# EAGLE design test-aetzen (EAGLE 7.1.0)
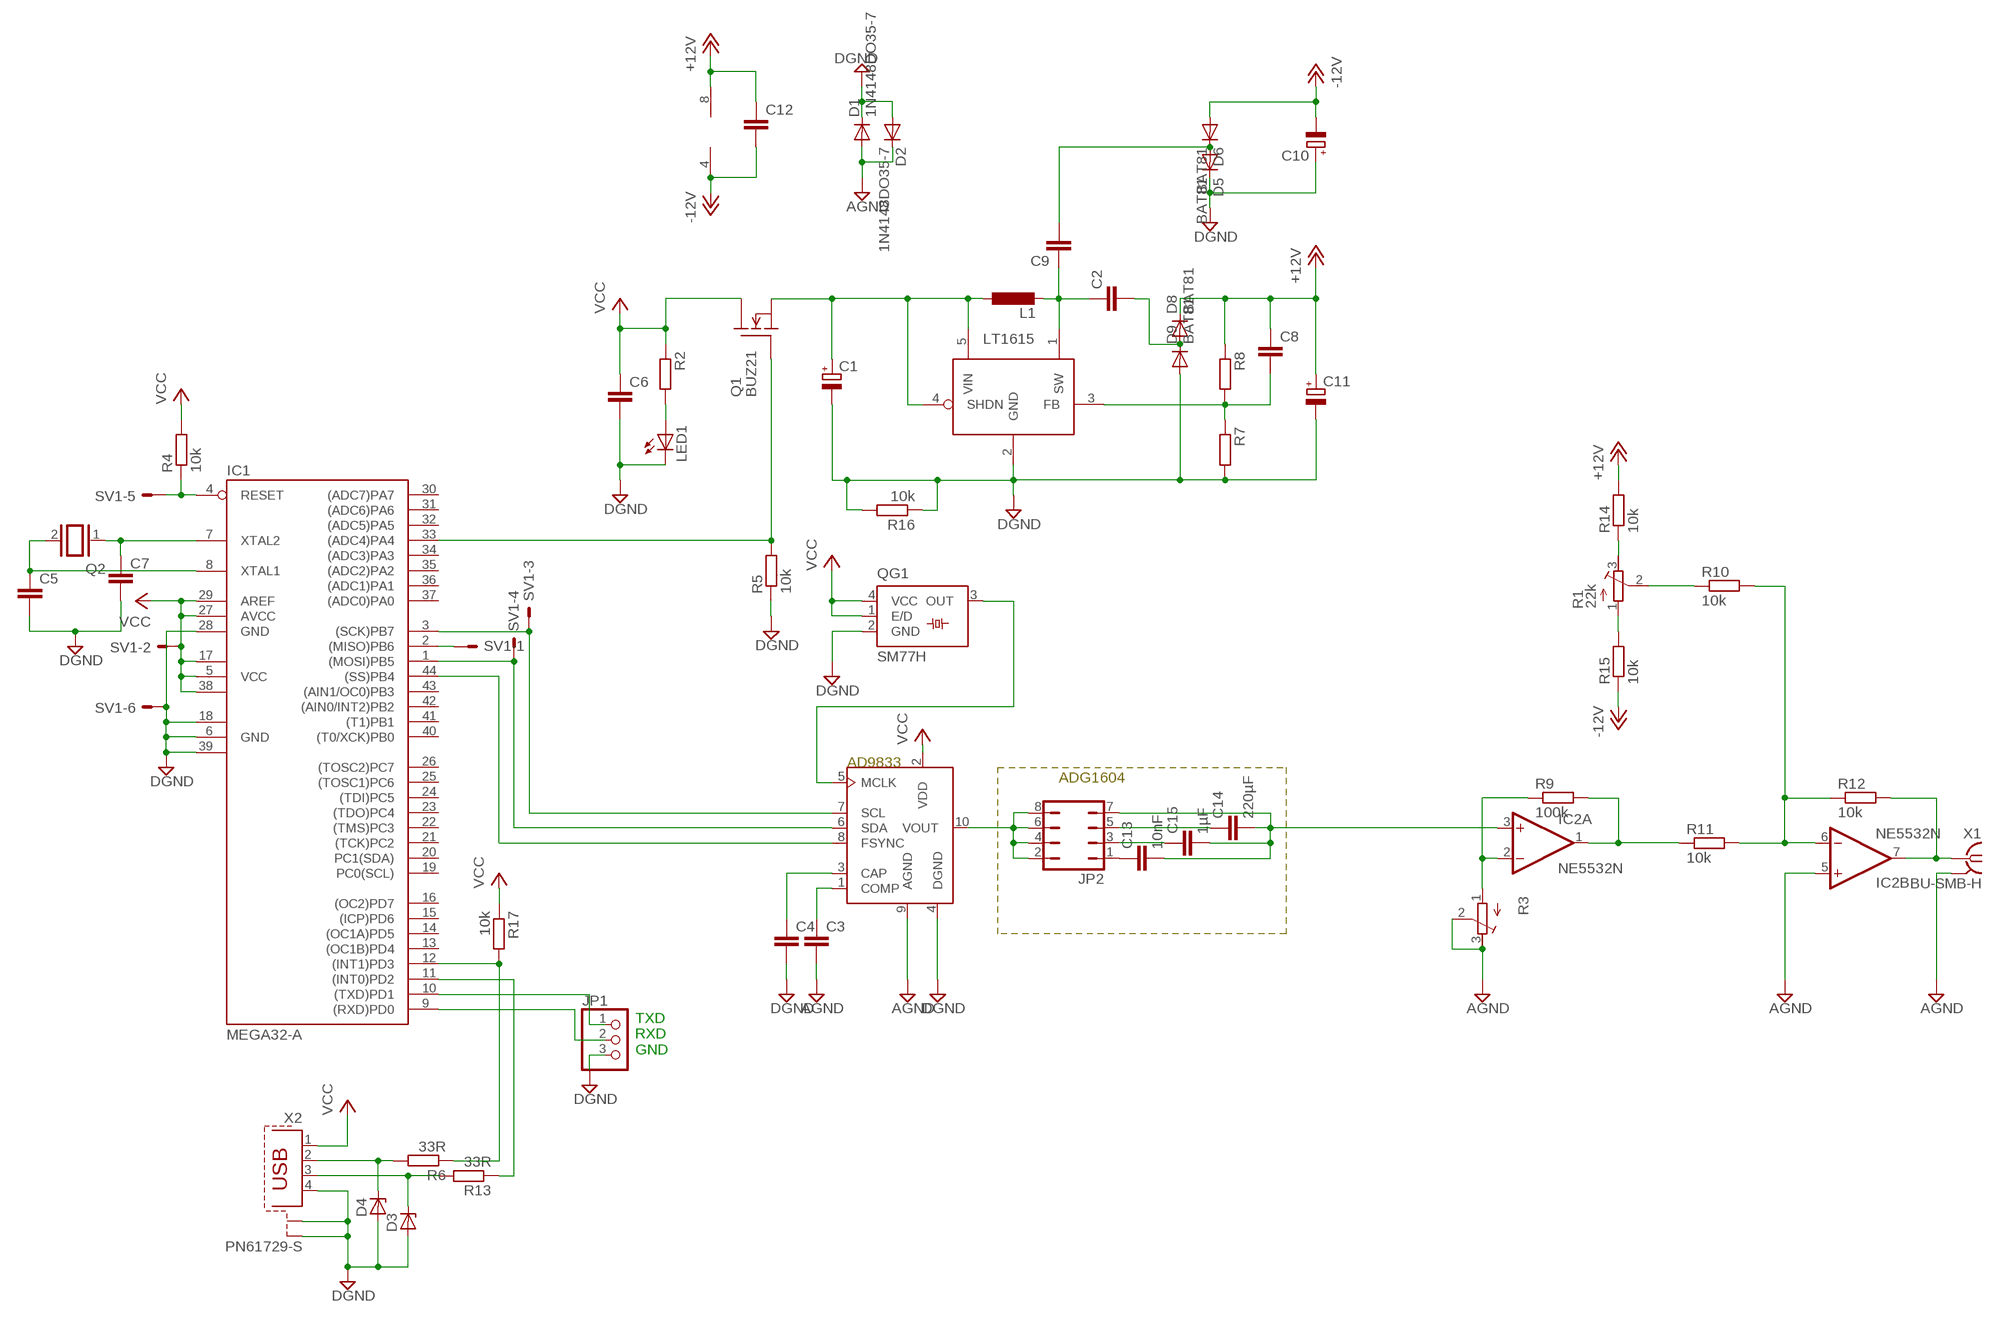
[diagram p0: schematic, sheet 1]

## Parts
C1  CPOL-EUE3.5-8  [E3,5-8]
C2  C-EU025-024X044  [C025-024X044]
C3  C-EU025-024X044  [C025-024X044]
C4  C-EU025-024X044  [C025-024X044]
C5  C-EU025-024X044  [C025-024X044]
C6  C-EU025-024X044  [C025-024X044]
C7  C-EU025-024X044  [C025-024X044]
C8  C-EU025-024X044  [C025-024X044]
C9  C-EU025-024X044  [C025-024X044]
C10  CPOL-EUE3.5-8  [E3,5-8]
C11  CPOL-EUE3.5-8  [E3,5-8]
C12  C-EU025-024X044  [C025-024X044]
C13  10nF  C-EU025-024X044  [C025-024X044]
C14  220µF  C-EU025-024X044  [C025-024X044]
C15  1µF  C-EU025-024X044  [C025-024X044]
D1  1N4148DO35-7  [DO35-7]
D2  1N4148DO35-7  [DO35-7]
D3  ZENER-DIODEDO35Z10  [DO35Z10]
D4  ZENER-DIODEDO35Z10  [DO35Z10]
D5  BAT81  [DO34-7]
D6  BAT81  [DO34-7]
D8  BAT81  [DO34-7]
D9  BAT81  [DO34-7]
IC1  MEGA32-A  [TQFP44]
IC2  NE5532N  [DIL08]
JP1  PINHD-1X3  [1X03]
JP2  JP4Q  [JP4Q]
L1  L-EU0207/10  [0207/10]
LED1  LED5MM  [LED5MM]
Q1  BUZ21  [TO220V]
Q2  XTAL/S  [QS]
QG1  SM77H  [SM77H]
R1  22k  R-TRIMM64Y  [RTRIM64Y]
R2  R-EU_0207/10  [0207/10]
R3  R-TRIMM64Y  [RTRIM64Y]
R4  10k  R-EU_M1206  [M1206]
R5  10k  R-EU_M1206  [M1206]
R6  33R  R-EU_0207/10  [0207/10]
R7  R-EU_0207/10  [0207/10]
R8  R-EU_0207/10  [0207/10]
R9  100k  R-EU_0207/10  [0207/10]
R10  10k  R-EU_M1206  [M1206]
R11  10k  R-EU_M1206  [M1206]
R12  10k  R-EU_M1206  [M1206]
R13  33R  R-EU_0207/10  [0207/10]
R14  10k  R-EU_M1206  [M1206]
R15  10k  R-EU_M1206  [M1206]
R16  10k  R-EU_M1206  [M1206]
R17  10k  R-EU_M1206  [M1206]
SV1  ML6E  [ML6]
U$1  AD9833-P  [DIL10]
U$2  LT1615  [SOT23-5]
X1  BU-SMB-H  [BU-SMB-H]
X2  PN61729-S  [PN61729-S]

## Nets
+12V: C8.1 C11.+ C12.1 D8.C IC2.8(P:V+) R8.1 R14.2
-12V: C10.- C12.2 D6.A IC2.4(P:V-) R15.1
AGND: C3.2 D1.A D2.C IC2.5(B:+IN) R3.2(S) R3.3(E) U$1.9(AGND) X1.2 X1.3 X1.4 X1.5
DGND: C1.- C4.2 C5.2 C6.2 C7.2 C10.+ C11.- D1.C D2.A D3.A D4.A D5.C D9.A IC1.6(GND) IC1.18(GND1) IC1.28(GND) IC1.39(GND2) JP1.3 LED1.K(C) QG1.2(GND) R5.1 R7.2 R16.1 R16.2 SV1.6 U$1.4(DGND) U$2.2(GND) X2.4 X2.S1 X2.S2
N$1: IC1.3((SCK)PB7) SV1.3 U$1.7(SCL)
N$2: IC1.12((INT1)PD3) R6.1 R17.2
N$3: C3.1 U$1.1(COMP)
N$4: IC1.1((MOSI)PB5) SV1.4 U$1.6(SDA)
N$5: IC1.11((INT0)PD2) R13.1
N$6: IC1.44((SS)PB4) U$1.8(FSYNC)
N$7: C1.+ L1.1 Q1.3(S) U$2.4(SHDN) U$2.5(VIN)
N$8: IC1.2((MISO)PB6) SV1.1
N$9: C4.1 U$1.3(CAP)
N$10: IC1.4(RESET) R4.1 SV1.5
N$11: QG1.3(OUT) U$1.5(MCLK)
N$12: IC1.33((ADC4)PA4) Q1.1(G) R5.2
N$13: D4.C R6.2 X2.2
N$14: D3.C R13.2 X2.3
N$15: R1.3(E) R14.1
N$16: IC1.9((RXD)PD0) JP1.2
N$17: LED1.A R2.2
N$18: R1.1(A) R15.2
N$19: C7.1 IC1.7(XTAL2) Q2.1
N$20: C8.2 R7.1 R8.2 U$2.3(FB)
N$21: JP2.2 JP2.4 JP2.6 JP2.8 U$1.10(VOUT)
N$22: C9.2 D5.A D6.C
N$23: C2.1 C9.1 L1.2 U$2.1(SW)
N$24: C14.1 JP2.5
N$25: C2.2 D8.A D9.C
N$26: C13.1 JP2.1
N$27: IC2.2(A:-IN) R3.1(A) R9.1
N$28: C13.2 C14.2 C15.2 IC2.3(A:+IN) JP2.7
N$29: IC2.1(A:OUT) R9.2 R11.1
N$30: IC2.6(B:-IN) R10.2 R11.2 R12.1
N$31: IC2.7(B:OUT) R12.2 X1.1
N$32: C15.1 JP2.3
N$33: C5.1 IC1.8(XTAL1) Q2.2
N$34: R1.2(S) R10.1
N$40: IC1.10((TXD)PD1) JP1.1
VCC: C6.1 IC1.5(VCC) IC1.17(VCC1) IC1.27(AVCC) IC1.29(AREF) IC1.38(VCC2) Q1.2(D) QG1.1(E/D) QG1.4(VCC) R2.1 R4.2 R17.1 SV1.2 U$1.2(VDD) X2.1
Unconnected: IC1.13((OC1B)PD4) IC1.14((OC1A)PD5) IC1.15((ICP)PD6) IC1.16((OC2)PD7) IC1.19(PC0(SCL)) IC1.20(PC1(SDA)) IC1.21((TCK)PC2) IC1.22((TMS)PC3) IC1.23((TDO)PC4) IC1.24((TDI)PC5) IC1.25((TOSC1)PC6) IC1.26((TOSC2)PC7) IC1.30((ADC7)PA7) IC1.31((ADC6)PA6) IC1.32((ADC5)PA5) IC1.34((ADC3)PA3) IC1.35((ADC2)PA2) IC1.36((ADC1)PA1) IC1.37((ADC0)PA0) IC1.40((T0/XCK)PB0) IC1.41((T1)PB1) IC1.42((AIN0/INT2)PB2) IC1.43((AIN1/OC0)PB3)

## Notes on the sheet
- AD9833
- ADG1604
- TXD
  RXD
  GND

## Library data of the parts
C1 C10 C11 = rcl:CPOL-EU: POLARIZED CAPACITOR, European symbol
C2-C9 C12-C15 = rcl:C-EU: CAPACITOR, European symbol
D1 D2 = diode:1N4148: DIODE high speed (Philips)
D3 D4 = diode:ZENER-DIODE: Z-Diode
D5 D6 D8 D9 = diode:BAT81: DIODE barrier diode
IC1 = atmel:MEGA32: MICROCONTROLLER 32 Kbytes FLASH 2 Kbytes SRAM 1 Kbytes EEPROM USART 8-channel 10 bit ADC Source: www.atmel.com .. doc2503.pdf; MPN: ATMEGA32-16AU; OC_FARNELL: 9171274; OC_NEWARK: 69K6677
IC2 = linear:NE5532: AUDIO AMPLIFIER
JP1 = pinhead:PINHD-1X3: PIN HEADER
JP2 = jumper:JP4Q: JUMPER
L1 = rcl:L-EU: INDUCTOR, European symbol
LED1 = led:LED: LED OSRAM: - CHIPLED LG R971, LG N971, LY N971, LG Q971, LY Q971, LO R971, LY R971 LH N974, LH R974 LS Q976, LO Q976, LY Q976 LO Q996 - Hyper CHIPLED LW Q18S LB Q993, LB Q99A, LB R99A - SideLED LS A670, LO A670, LY A670, LG A670, LP A670 LB A673, LV A673, LT A673, LW A673 LH A674 LY A675 LS A676, LA A676, LO A676, LY A676, LW A676 LS A679, LY A679, LG A679 - Hyper Micro SIDELED® LS Y876, LA Y876, LO Y876, LY Y876 LT Y87S - SmartLED LW L88C, LW L88S LB L89C, LB L89S, LG L890 LS L89K, LO L89K, LY L89K LS L896, LA L896, LO L896, LY L896 - TOPLED LS T670, LO T670, LY T670, LG T670, LP T670 LSG T670, LSP T670, LSY T670, LOP T670, LYG T670 LG T671, LOG T671, LSG T671 LB T673, LV T673, LT T673, LW T673 LH T674 LS T676, LA T676, LO T676, LY T676, LB T676, LH T676, LSB T676, LW T676 LB T67C, LV T67C, LT T67C, LS T67K, LO T67K, LY T67K, LW E67C LS E67B, LA E67B, LO E67B, LY E67B, LB E67C, LV E67C, LT E67C LW T67C LS T679, LY T679, LG T679 LS T770, LO T770, LY T770, LG T770, LP T770 LB T773, LV T773, LT T773, LW T773 LH T774 LS E675, LA E675, LY E675, LS T675 LS T776, LA T776, LO T776, LY T776, LB T776 LHGB T686 LT T68C, LB T68C - Hyper Mini TOPLED® LB M676 - Mini TOPLED Santana® LG M470 LS M47K, LO M47K, LY M47K Source: http://www.osram.convergy.de LUXEON: - LUMILED® LXK2-PW12-R00, LXK2-PW12-S00, LXK2-PW14-U00, LXK2-PW14-V00 LXK2-PM12-R00, LXK2-PM12-S00, LXK2-PM14-U00 LXK2-PE12-Q00, LXK2-PE12-R00, LXK2-PE12-S00, LXK2-PE14-T00, LXK2-PE14-U00 LXK2-PB12-K00, LXK2-PB12-L00, LXK2-PB12-M00, LXK2-PB14-N00, LXK2-PB14-P00, LXK2-PB14-Q00 LXK2-PR12-L00, LXK2-PR12-M00, LXK2-PR14-Q00, LXK2-PR14-R00 LXK2-PD12-Q00, LXK2-PD12-R00, LXK2-PD12-S00 LXK2-PH12-R00, LXK2-PH12-S00 LXK2-PL12-P00, LXK2-PL12-Q00, LXK2-PL12-R00 Source: www.luxeon.com KINGBRIGHT: KA-3528ASYC Source: www.kingbright.com
Q1 = transistor-fet:BUZ21: N-Channel Enhancement MOSFET 100V; 19A; 0,1Ohm
Q2 = special:XTAL/S: CRYSTAL
QG1 = crystal:SM77H: 3.3V CMOS Clock Oscillator Source: www.pletronics.com .. sm77h%203.3v.pdf; OC_FARNELL: unknown; OC_NEWARK: unknown
R1 R3 = rcl:R-TRIMM: Trimm resistor
R2 R4-R17 = rcl:R-EU_: RESISTOR, European symbol
SV1 = con-harting-ml:ML6?E: HARTING; OC_FARNELL: unknown; OC_NEWARK: unknown
U$1 = analog-devices:AD9833: AD9833 DDS-IC Information: analog.com
U$2 = linear:LT1615
X1 = con-coax:BU-SMB-H: FEMALE SMB CONNECTOR Radiall distributor RS 112-3003; OC_FARNELL: unknown; OC_NEWARK: unknown
X2 = con-berg:PN61729-S: BERG USB connector; OC_FARNELL: unknown; OC_NEWARK: unknown

## Board
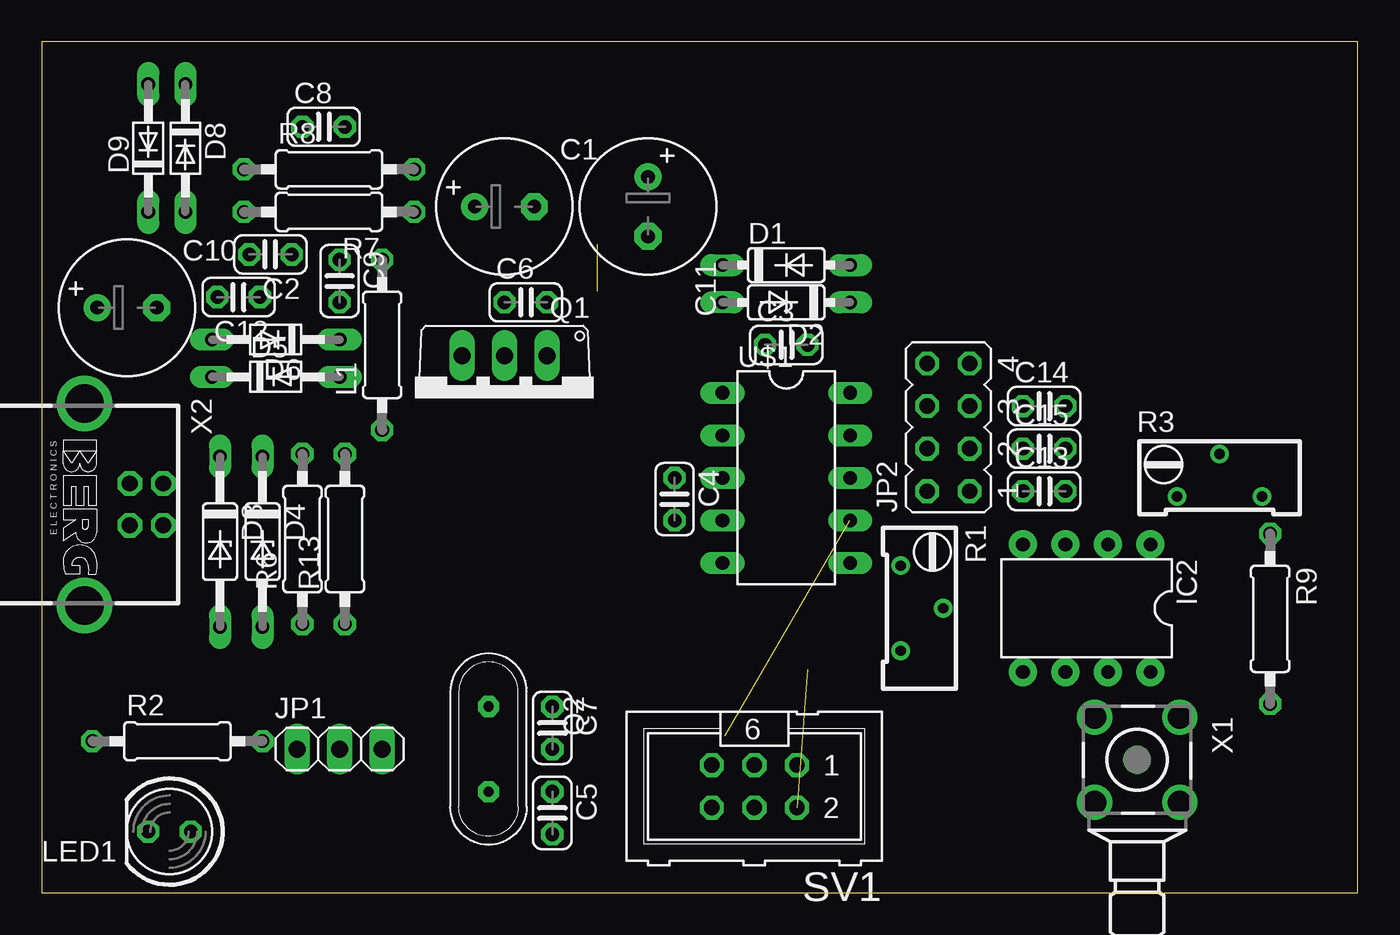
[diagram p1: board, top side]
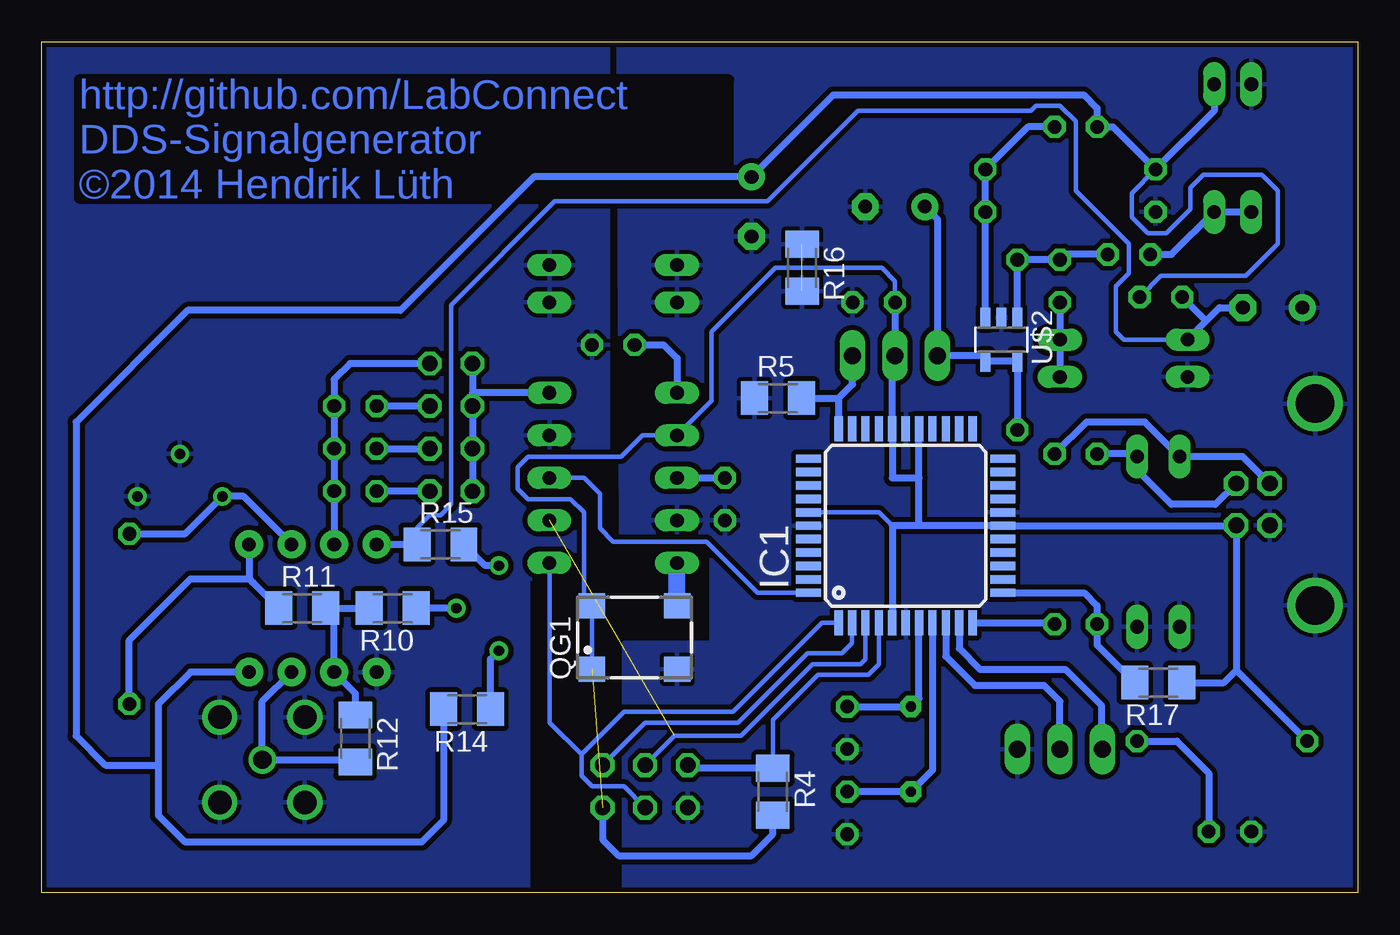
[diagram p2: board, bottom side, seen from below]

Size 78.57 x 50.79 mm. Coordinates in mm from the lower left corner, seen from the top.
Outline: 0,0 78.57,0 78.57,50.79 0,50.79 0,0
Copper layers (1*16): Top 0.035mm / dielectric 1.5mm / Bottom 0.035mm
Design rules "default *": minimum track width 10mil, minimum drill 24mil, track to track 10mil, track to pad 10mil, pad to pad 10mil, via to via 10mil, smd to smd 10mil, copper to edge 10mil, drill to drill 8mil, minimum pad ring 10mil, minimum via ring 8mil, stop-mask expansion 4mil, vias tented up to drill 0mil, thermal gap 10mil

### Footprints (pad centres in the part's own frame; a part is rotated, then mirrored left to right if it is on the bottom)
E3,5-8 = drill 0.813 pad 1.6: + -1.778,0 | drill 0.813 pad 1.6 octagon: - 1.778,0
C025-024X044 = drill 0.813 octagon: 1 -1.27,0; 2 1.27,0
DO35-7 = drill 0.813 long: A 3.81,0; C -3.81,0
DO35Z10 = drill 0.813 long: A 5.08,0; C -5.08,0
DO34-7 = drill 0.813 long: A 3.81,0; C -3.81,0
TQFP44 = smd 1.5 x 0.5: 1 -5.8,4; 2 -5.8,3.2; 3 -5.8,2.4; 4 -5.8,1.6; 5 -5.8,0.8; 6 -5.8,0; 7 -5.8,-0.8; 8 -5.8,-1.6; 9 -5.8,-2.4; 10 -5.8,-3.2; 11 -5.8,-4; 23 5.8,-4; 24 5.8,-3.2; 25 5.8,-2.4; 26 5.8,-1.6; 27 5.8,-0.8; 28 5.8,0; 29 5.8,0.8; 30 5.8,1.6; 31 5.8,2.4; 32 5.8,3.2; 33 5.8,4 | smd 0.5 x 1.5: 12 -4,-5.8; 13 -3.2,-5.8; 14 -2.4,-5.8; 15 -1.6,-5.8; 16 -0.8,-5.8; 17 0,-5.8; 18 0.8,-5.8; 19 1.6,-5.8; 20 2.4,-5.8; 21 3.2,-5.8; 22 4,-5.8; 34 4,5.8; 35 3.2,5.8; 36 2.4,5.8; 37 1.6,5.8; 38 0.8,5.8; 39 0,5.8; 40 -0.8,5.8; 41 -1.6,5.8; 42 -2.4,5.8; 43 -3.2,5.8; 44 -4,5.8
DIL08 = drill 0.813 pad 1.676: 1 -3.81,-3.81; 2 -1.27,-3.81; 3 1.27,-3.81; 4 3.81,-3.81; 5 3.81,3.81; 6 1.27,3.81; 7 -1.27,3.81; 8 -3.81,3.81
1X03 = drill 1.016 long: 1 -2.54,0; 2 0,0; 3 2.54,0
JP4Q = drill 0.914 octagon: 1 -3.81,-1.27; 2 -3.81,1.27; 3 -1.27,-1.27; 4 -1.27,1.27; 5 1.27,-1.27; 6 1.27,1.27; 7 3.81,-1.27; 8 3.81,1.27
0207/10 = drill 0.813 octagon: 1 -5.08,0; 2 5.08,0
LED5MM = drill 0.813 octagon: A -1.27,0; K 1.27,0
TO220V = drill 1.016 long: 1 -2.54,-2.54; 2 0,-2.54; 3 2.54,-2.54
QS = drill 0.61 pad 1.27 octagon: 1 -2.54,0; 2 2.54,0
SM77H = smd 1.6 x 1.5: 1 -2.55,-1.9; 2 2.55,-1.9; 3 2.55,1.9; 4 -2.55,1.9
RTRIM64Y = drill 0.61: 1 0,-2.54; 2 -2.54,0; 3 0,2.54
M1206 = smd 1.6 x 2: 1 -1.4,0; 2 1.4,0
ML6 = drill 0.914 octagon: 1 -2.54,-1.27; 2 -2.54,1.27; 3 0,-1.27; 4 0,1.27; 5 2.54,-1.27; 6 2.54,1.27
DIL10 = drill 0.813 long: 1 -5.08,-3.81; 2 -2.54,-3.81; 3 0,-3.81; 4 2.54,-3.81; 5 5.08,-3.81; 6 5.08,3.81; 7 2.54,3.81; 8 0,3.81; 9 -2.54,3.81; 10 -5.08,3.81
SOT23-5 = smd 0.6 x 1.2: 1 -0.95,-1.306; 2 0,-1.306; 3 0.95,-1.306; 4 0.95,1.306; 5 -0.95,1.306
BU-SMB-H = drill 1.1: 1 0,0 | drill 1.4: 2 -2.54,2.54; 3 2.54,2.54; 4 2.54,-2.54; 5 -2.54,-2.54
PN61729-S = drill 0.95 octagon: 1 1.25,4.71; 2 -1.25,4.71; 3 -1.25,2.71; 4 1.25,2.71 | drill 2.3 pad 2.9: S1 -6.02,0; S2 6.02,0

### Placement (x,y rotation side)
C1  27.62,40.96 0 top
C2  13.65,38.1 180 top
C3  44.45,32.7 0 top
C4  37.78,23.5 270 top
C5  30.48,4.76 270 top
C6  28.89,35.24 0 top
C7  30.48,9.84 270 top
C8  16.83,45.72 0 top
C9  17.78,36.51 270 top
C10  5.08,34.92 0 top
C11  36.2,40.96 270 top
C12  11.75,35.56 180 top
C13  59.85,23.97 0 top
C14  59.85,29.05 0 top
C15  59.85,26.51 0 top
D1  44.45,37.47 0 top
D2  44.45,35.24 180 top
D3  10.64,20.95 270 top
D4  13.18,20.95 270 top
D5  13.97,30.8 0 top
D6  13.97,33.02 180 top
D8  8.57,44.45 270 top
D9  6.35,44.45 90 top
IC1  26.99,21.91 90 bottom
IC2  62.39,16.99 180 top
JP1  17.78,8.57 0 top
JP2  54.13,27.78 90 top
L1  20.32,32.7 90 top
LED1  7.62,3.65 180 top
Q1  27.62,29.53 180 top
Q2  26.67,8.57 270 top
QG1  43.18,15.24 0 bottom
R1  51.28,16.99 180 top
R2  8.1,9.05 0 top
R3  70.33,23.65 270 top
R4  34.92,6.03 270 bottom
R5  34.61,29.53 0 bottom
R6  15.56,21.11 90 top
R7  17.14,40.64 180 top
R8  17.14,43.18 0 top
R9  73.34,16.35 270 top
R10  57.63,16.99 180 bottom
R11  63.02,16.99 0 bottom
R12  59.85,9.21 270 bottom
R13  18.1,21.11 90 top
R14  53.18,10.95 180 bottom
R15  54.77,20.8 0 bottom
R16  33.18,37.31 270 bottom
R17  11.91,12.54 180 bottom
SV1  42.55,6.35 180 top
U$1  44.45,24.77 270 top
U$2  21.27,33.02 180 bottom
X1  65.41,7.94 270 top
X2  2.54,23.18 270 top

### Tracks (layer width: path | path; a pad name or v marks a point on that pad's centre or on a via)
+12V
  Bottom 0.254: C12.1 11.75,36.83 6.67,36.83 4.76,38.73 4.76,41.91 5.71,42.86 9.21,42.86 10,42.07 10,40.8 11.43,39.37 12.54,39.37 13.49,40.32 13.49,41.75 R8.1
  Bottom 0.406: D8.C 8.57,46.67 R8.1 14.61,45.72 C8.1 15.56,46.83 16.35,47.62 31.3,47.62 C11.+ 49.18,42.74 57.15,34.77 69.85,34.77 76.52,28.1 76.52,9.37 74.77,7.62 71.6,7.62 | R14.2 54.58,4.32 55.88,3.02 70.01,3.02 71.6,4.6 71.6,7.62 | 71.6,7.62 71.6,11.27 69.69,13.18 IC2.8
-12V
  Bottom 0.254: R15.1 56.17,21.78 55.4,22.54 54.77,22.54 54.13,23.18 54.13,35.08 47.94,41.27 35.24,41.27 29.84,46.67 19.53,46.67 19.21,46.99 17.78,46.99 16.83,46.04 16.83,41.91 13.65,38.73 13.65,36.99 14.45,36.2 14.45,33.5 13.97,33.02 D6.A
  Bottom 0.406: IC2.4 R15.1 | D6.A 8.97,34.21 | 8.97,34.21 8.26,34.92 C10.- | C12.2 9.13,34.21 8.97,34.21
AGND
  pour Bottom (isolate 0.305): 78.58,0 49.53,0 49.53,18.73 44.77,18.73 44.77,50.96 78.58,50.96
DGND  (1 unrouted)
  pour Bottom (isolate 0.305): 0,0 43.81,0 43.81,14.92 38.58,14.92 38.58,21.11 43.97,21.11 44.13,51.12 0,50.8
N$1  (1 unrouted)
  Bottom 0.254: IC1.3 29.39,13.95 29.69,13.65 32.54,13.65 36.83,9.37 40.8,9.37 SV1.3
N$2
  Bottom 0.406: IC1.12 16.32,17.91 15.56,17.14 R6.1 15.56,14.79 R17.2
N$3
  Bottom 0.406: C3.1 41.43,32.7 40.64,31.91 U$1.1
N$4
  Bottom 0.254: SV1.4 43.81,6.35 45.72,6.35 46.35,6.99 46.35,8.26 | 46.35,8.26 43.81,10.79 37.31,10.79 31.99,16.11 IC1.1 | U$1.6 48.26,10.16 46.35,8.26
N$5
  Bottom 0.406: IC1.11 18.17,16.11 R13.1
N$6
  Bottom 0.254: U$1.8 46.2,24.77 45.24,23.81 45.24,21.75 44.45,20.95 38.89,20.95 35.85,17.91 IC1.44
N$7
  Bottom 0.406: L1.1 U$2.5 U$2.4 22.22,32.07 Q1.3 25.08,40.2 C1.+
N$8
  Bottom 0.254: SV1.1 42.55,10.16 36.99,10.16 32.86,14.29 30.8,14.29 30.19,14.9 IC1.2
N$9
  Bottom 0.406: U$1.3 C4.1
N$10
  Bottom 0.254: IC1.4 28.59,13.64 29.21,13.02 32.23,13.02 34.92,10.32 R4.1
  Bottom 0.406: R4.1 39.82,7.43 SV1.5
N$11
  Bottom 1.016: QG1.3 40.64,16.99 U$1.5
N$12
  Bottom 0.406: 30.99,29.53 IC1.33 | R5.2 30.99,29.53 | 30.99,29.53 30.16,30.35 Q1.1
N$13
  Bottom 0.406: X2.2 8.5,23.18 11.11,23.18 13.18,25.24 D4.C 13.34,26.19 R6.2
N$14
  Bottom 0.406: X2.3 6.86,26.04 D3.C 12.7,28.1 16.19,28.1 R13.2
N$15
  Bottom 0.406: R14.1 51.78,13.94 R1.3
N$16
  Bottom 0.406: IC1.9 24.59,14.11 22.86,12.38 18.73,12.38 17.78,11.43 JP1.2
N$17
  Bottom 0.406: R2.2 10.79,9.05 8.89,7.14 LED1.A
N$18
  Bottom 0.406: R1.1 52.1,19.53 R15.2
N$19
  Bottom 0.406: C7.1 Q2.1 26.19,11.6 IC1.7
N$20
  Bottom 0.406: U$2.3 R7.1 R8.2 19.68,45.72 C8.2
N$21
  Bottom 0.406: JP2.8 52.86,29.84 | 52.86,29.84 JP2.6 JP2.4 JP2.2 | U$1.10 52.86,29.84
N$22
  Bottom 0.406: C9.2 D6.C D5.A
N$23
  Bottom 0.406: U$2.1 L1.2 C9.1 17.46,38.1 C2.1
N$24
  Bottom 0.406: JP2.5 C14.1
N$25
  Bottom 0.406: C2.2 11.11,38.1 D8.A D9.C
N$26
  Bottom 0.406: JP2.1 C13.1
N$27
  Bottom 0.406: IC2.2 66.52,23.65 R3.1 70.01,21.43 R9.1
N$28
  Bottom 0.406: JP2.7 60.17,31.59 61.12,30.64 C14.2 C15.2 | C15.2 C13.2 | C15.2 IC2.3
N$29
  Bottom 0.406: IC2.1 66.2,18.76 66.17,18.73 | R11.1 65.95,18.51 66.17,18.73 | R9.2 73.34,15.08 69.69,18.73 66.17,18.73
N$30
  Bottom 0.406: R10.2 R11.2 61.12,16.48 IC2.6 59.85,11.91 R12.1
N$31
  Bottom 0.406: IC2.7 65.41,11.43 X1.1 59.98,7.94 R12.2
N$32
  Bottom 0.406: C15.1 JP2.3
N$33
  Bottom 0.406: IC1.8 25.39,7.32 Q2.2 C5.1
N$34
  Bottom 0.406: R1.2 R10.1
N$40
  Bottom 0.406: IC1.10 23.79,14.58 22.54,13.34 17.46,13.34 15.28,11.15 15.28,8.57 JP1.1
VCC  (1 unrouted)
  Bottom 0.254: QG1.1 QG1.4 46.2,17.61 46.2,22.7 46.99,23.5 49.53,23.5 50.16,24.13 50.16,25.4 49.53,26.04 43.97,26.04 42.7,27.3 U$1.2 38.58,29.37 38.58,33.5 34.77,37.31 28.42,37.31 27.62,36.51 C6.1 | IC1.38 28.59,22.71 27.79,21.91
  Bottom 0.406: 7.25,13.28 X2.1 7.27,21.91 IC1.17 26.19,21.91 | 7.25,13.28 R2.1 | SV1.2 45.09,3.17 44.13,2.22 36.2,2.22 34.92,3.49 R4.2 | 26.19,21.91 26.19,24.77 | 26.19,24.77 IC1.27 | 26.19,21.91 27.79,21.91 IC1.5 | 26.19,24.77 27.79,24.77 IC1.29 27.79,31.9 Q1.2 C6.1 | R17.1 7.99,12.54 7.25,13.28

### Text on the board
Bottom: http://github.com/LabConnect / DDS-Signalgenerator / ©2014 Hendrik Lüth